# EAGLE design NodeNadelAdapterLayer1 (EAGLE 6.1)
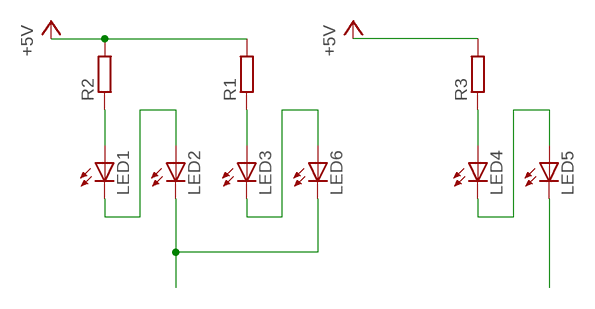
[diagram p0: schematic, sheet 1]

## Parts
LED1  LEDSML0805  [SML0805]
LED2  LEDSML0805  [SML0805]
LED3  LEDSML0805  [SML0805]
LED4  LEDSML0805  [SML0805]
LED5  LEDSML0805  [SML0805]
LED6  LEDSML0805  [SML0805]
R1  R-EU_R0603  [R0603]
R2  R-EU_R0603  [R0603]
R3  R-EU_R0603  [R0603]

## Nets
+5V: R1.2 R2.2 R3.2
N$1: LED2.C LED6.C
N$2: LED1.A R2.1
N$3: LED1.C LED2.A
N$4: LED3.C LED6.A
N$5: LED3.A R1.1
N$6: LED5.C
N$8: LED4.A R3.1
N$9: LED4.C LED5.A

## Library data of the parts
LED1-LED6 = led:LED: LED OSRAM: - CHIPLED LG R971, LG N971, LY N971, LG Q971, LY Q971, LO R971, LY R971 LH N974, LH R974 LS Q976, LO Q976, LY Q976 LO Q996 - Hyper CHIPLED LW Q18S LB Q993, LB Q99A, LB R99A - SideLED LS A670, LO A670, LY A670, LG A670, LP A670 LB A673, LV A673, LT A673, LW A673 LH A674 LY A675 LS A676, LA A676, LO A676, LY A676, LW A676 LS A679, LY A679, LG A679 - Hyper Micro SIDELED® LS Y876, LA Y876, LO Y876, LY Y876 LT Y87S - SmartLED LW L88C, LW L88S LB L89C, LB L89S, LG L890 LS L89K, LO L89K, LY L89K LS L896, LA L896, LO L896, LY L896 - TOPLED LS T670, LO T670, LY T670, LG T670, LP T670 LSG T670, LSP T670, LSY T670, LOP T670, LYG T670 LG T671, LOG T671, LSG T671 LB T673, LV T673, LT T673, LW T673 LH T674 LS T676, LA T676, LO T676, LY T676, LB T676, LH T676, LSB T676, LW T676 LB T67C, LV T67C, LT T67C, LS T67K, LO T67K, LY T67K, LW E67C LS E67B, LA E67B, LO E67B, LY E67B, LB E67C, LV E67C, LT E67C LW T67C LS T679, LY T679, LG T679 LS T770, LO T770, LY T770, LG T770, LP T770 LB T773, LV T773, LT T773, LW T773 LH T774 LS E675, LA E675, LY E675, LS T675 LS T776, LA T776, LO T776, LY T776, LB T776 LHGB T686 LT T68C, LB T68C - Hyper Mini TOPLED® LB M676 - Mini TOPLED Santana® LG M470 LS M47K, LO M47K, LY M47K Source: http://www.osram.convergy.de LUXEON: - LUMILED® LXK2-PW12-R00, LXK2-PW12-S00, LXK2-PW14-U00, LXK2-PW14-V00 LXK2-PM12-R00, LXK2-PM12-S00, LXK2-PM14-U00 LXK2-PE12-Q00, LXK2-PE12-R00, LXK2-PE12-S00, LXK2-PE14-T00, LXK2-PE14-U00 LXK2-PB12-K00, LXK2-PB12-L00, LXK2-PB12-M00, LXK2-PB14-N00, LXK2-PB14-P00, LXK2-PB14-Q00 LXK2-PR12-L00, LXK2-PR12-M00, LXK2-PR14-Q00, LXK2-PR14-R00 LXK2-PD12-Q00, LXK2-PD12-R00, LXK2-PD12-S00 LXK2-PH12-R00, LXK2-PH12-S00 LXK2-PL12-P00, LXK2-PL12-Q00, LXK2-PL12-R00 Source: www.luxeon.com KINGBRIGHT: KA-3528ASYC Source: www.kingbright.com
R1-R3 = rcl:R-EU_: RESISTOR, European symbol

## Board
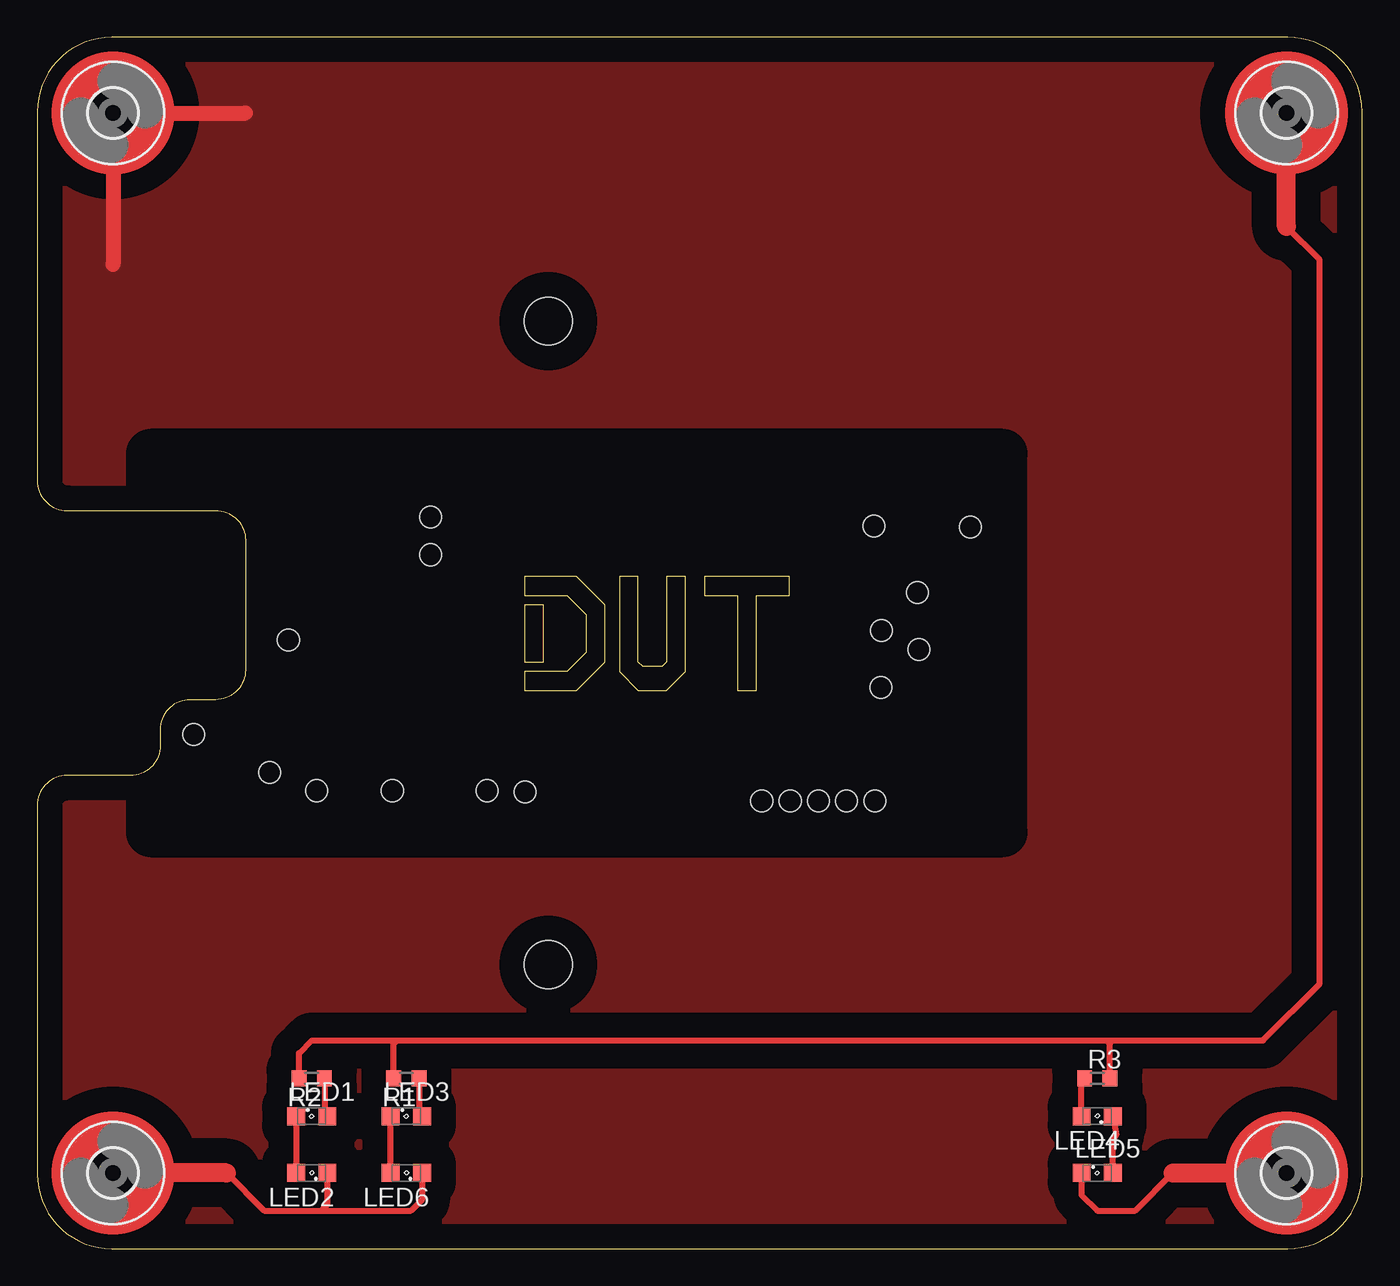
[diagram p1: board, top side]

Size 88.9 x 81.28 mm. Coordinates in mm from the lower left corner, seen from the top.
Outline: 8.26,34.83 8.26,33.75 arc-90 6.25,31.75 2,31.75 arc90 0,29.75 0,5 arc90 5,0 83.9,0 arc90 88.9,5 88.9,76.28 arc90 83.9,81.28 5,81.28 arc90 0,76.28 0,51.53 arc90 2,49.53 11.97,49.53 arc-90 13.97,47.53 13.97,38.83 arc-90 11.97,36.83 10.26,36.83 arc90 8.26,34.83
Outline: 32.7,39.37 33.97,39.37 33.97,43.18 32.7,43.18 32.7,39.37
Outline: 32.7,38.73 32.7,37.47 36.2,37.47 38.1,39.37 38.1,43.18 36.2,45.09 32.7,45.09 32.7,43.81 35.56,43.81 36.83,42.55 36.83,40.01 35.56,38.73 32.7,38.73
Outline: 39.05,45.09 39.05,38.73 40.32,37.47 42.23,37.47 43.5,38.73 43.5,45.09 42.23,45.09 42.23,39.37 41.91,39.05 40.64,39.05 40.32,39.37 40.32,45.09 39.05,45.09
Outline: 44.77,45.09 44.77,43.81 46.99,43.81 46.99,37.47 48.26,37.47 48.26,43.81 50.48,43.81 50.48,45.09 44.77,45.09
Copper layers (1*16): Top 0.035mm / dielectric 1.5mm / Bottom 0.035mm
Design rules: minimum track width 10mil, minimum drill 24mil, track to track 8mil, track to pad 8mil, pad to pad 8mil, via to via 8mil, smd to smd 8mil, copper to edge 40mil, drill to drill 8mil, minimum pad ring 10mil, minimum via ring 8mil, stop-mask expansion 4mil, vias tented up to drill 0mil, thermal gap 10mil
Holes 1.45 mm at 10.5,34.49 15.58,31.95 30.17,30.73 32.72,30.65 26.39,46.55 26.38,49.09 48.61,30.05 50.52,30.05 52.42,30.05 54.3,30.05 56.22,30.05 56.62,37.65 59.16,40.21 56.63,41.46 59.06,44.02 62.62,48.43 56.14,48.48 16.85,40.84 23.82,30.73 18.74,30.73
Holes 3.2 mm at 34.29,19.05 34.29,62.23
tRestrict: area 7.6,27.9 to 64.8,53.3

### Footprints (pad centres in the part's own frame; a part is rotated, then mirrored left to right if it is on the bottom)
3,2 = hole 3.2: 0,0
SML0805 = smd 1.2 x 1.2: A 1.05,0; C -1.05,0
R0603 = smd 1 x 1.1: 1 -0.85,0; 2 0.85,0

### Placement (x,y rotation side)
H1  MOUNT-HOLE3.2  [3,2]  5.08,5.08 0 top
H2  MOUNT-HOLE3.2  [3,2]  5.08,76.2 0 top
H3  MOUNT-HOLE3.2  [3,2]  83.82,5.08 0 top
H4  MOUNT-HOLE3.2  [3,2]  83.82,76.2 0 top
LED1  18.41,8.89 0 top
LED2  18.41,5.08 180 top
LED3  24.77,8.89 0 top
LED4  71.12,8.89 180 top
LED5  71.12,5.08 0 top
LED6  24.77,5.08 180 top
R1  24.77,11.43 180 top
R2  18.41,11.43 180 top
R3  71.12,11.43 0 top

### Tracks (layer width: path | path; a pad name or v marks a point on that pad's centre or on a via)
+5V
  Top 0.406: R2.2 17.57,13.12 18.41,13.97 24.13,13.97 | 24.13,13.97 71.75,13.97 | 71.75,13.97 82.23,13.97 86.04,17.78 86.04,66.36 83.82,68.58 | R3.2 71.97,13.76 71.75,13.97 | R1.2 23.91,13.76 24.13,13.97
  Top 1.27: 83.82,68.58 83.82,76.2
GND
  Top 1.016: 13.97,76.2 5.08,76.2 5.08,66.04
  pour Top (isolate 1.676): 11.97,31.75 2,31.75 arc90 0,29.75 0,5 arc90 5,0 83.9,0 arc90 88.9,5 88.9,76.28 arc90 83.9,81.28 5,81.28 arc90 0,76.28 0,51.53 arc90 2,49.53 11.97,49.53 arc-90 13.97,47.53 13.97,33.75 arc-90
N$1
  Top 0.406: 12.7,5.08 15.24,2.54 19.05,2.54 | 19.05,2.54 25.08,2.54 25.82,3.27 LED6.C | LED2.C 19.46,2.96 19.05,2.54
  Top 1.27: 12.7,5.08 5.08,5.08
N$2
  Top 0.406: R2.1 19.27,9.09 LED1.A
N$3
  Top 0.406: LED1.C LED2.A
N$4
  Top 0.406: LED6.A 23.71,8.67 23.5,8.89 LED3.C
N$5
  Top 0.406: R1.1 25.61,9.31 26.04,8.89 LED3.A
N$6
  Top 0.406: LED5.C 70.07,3.59 71.12,2.54 73.66,2.54 76.2,5.08
  Top 1.27: 76.2,5.08 83.82,5.08
N$8
  Top 0.406: LED4.A 70.07,11.23 R3.1
N$9
  Top 0.406: LED5.A 72.17,7.4 72.39,7.62 LED4.C
(copper drawn outside any net)
  shapes: Top circle x6